# EAGLE design bqcreative_v2 (EAGLE 7.2.0)

## Sheet 1 of 3
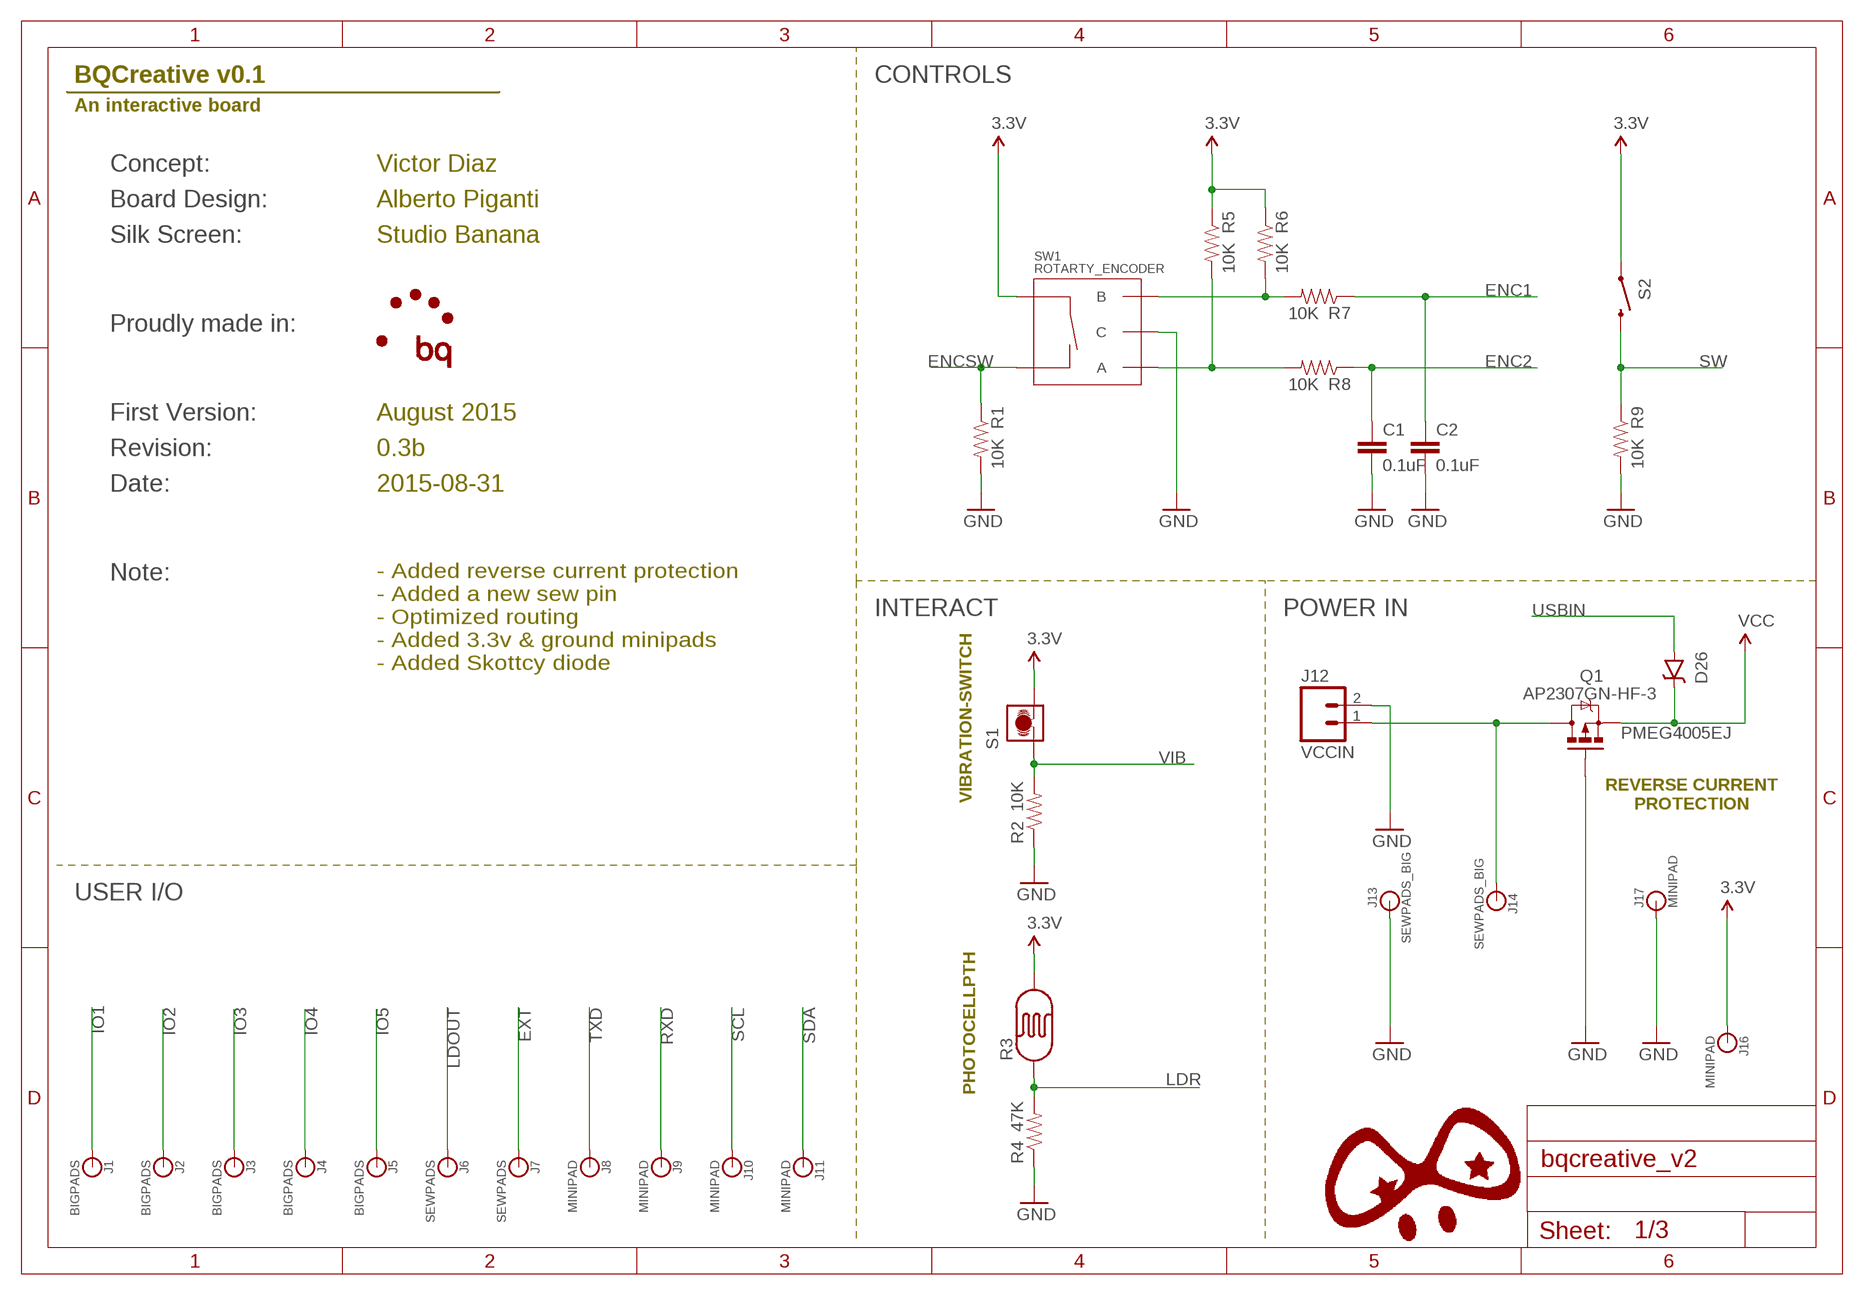
[diagram p0: schematic, sheet 1]

### Parts
C1  0.1uF  CAP0603-CAP  [0603-CAP]
C2  0.1uF  CAP0603-CAP  [0603-CAP]
D26  PMEG4005EJ  DIODE-SCHOTTKY-PMEG4005EJ  [SOD-323]
J1  BIGPADS  [BIGPAD]
J2  BIGPADS  [BIGPAD]
J3  BIGPADS  [BIGPAD]
J4  BIGPADS  [BIGPAD]
J5  BIGPADS  [BIGPAD]
J6  SEWPADS  [SEWPAD]
J7  SEWPADS  [SEWPAD]
J8  MINIPAD  [MINIPAD]
J9  MINIPAD  [MINIPAD]
J10  MINIPAD  [MINIPAD]
J11  MINIPAD  [MINIPAD]
J12  VCCIN  M02POLAR  [MOLEX-1X2]
J13  SEWPADS_BIG  [SEWPAD_BIG]
J14  SEWPADS_BIG  [SEWPAD_BIG]
J16  MINIPAD  [MINIPAD]
J17  MINIPAD  [MINIPAD]
Q1  AP2307GN-HF-3  MOSFET-PCHANNEL  [SOT23-3]
R1  10K  RESISTOR0402-RES  [0402-RES]
R2  10K  RESISTOR0402-RES  [0402-RES]
R3  PHOTOCELLPTH  [PHOTOCELL]
R4  47K  RESISTOR0402-RES  [0402-RES]
R5  10K  RESISTOR0402-RES  [0402-RES]
R6  10K  RESISTOR0402-RES  [0402-RES]
R7  10K  RESISTOR0402-RES  [0402-RES]
R8  10K  RESISTOR0402-RES  [0402-RES]
R9  10K  RESISTOR0402-RES  [0402-RES]
S1  VIBRATION-SWITCH  [VIBRATION-SWITCH]
S2  SWITCH-MOMENTARY-2SMD  [TACTILE-SWITCH-SMD]
SW1  ROTARTY_ENCODER  [ROTARY_ENC_PLAIN]

### Nets
3.3V: J16.P$1 J16.P$2 R3.2 R5.1 R6.1 S1.2 S2.1 SW1.SW+ ; also sheet 2
ENC1: C2.1 R7.1 ; also sheet 2
ENC2: C1.1 R8.1 ; also sheet 2
ENCSW: R1.1 SW1.SW- ; also sheet 2
EXT: J7.P$1 ; also sheet 2
GND: C1.2 C2.2 J12.2 J13.P$1 J17.P$1 J17.P$2 Q1.1(G) R1.2 R2.1 R4.1 R9.2 SW1.C ; also sheet 2,3
IO1: J1.P$1 ; also sheet 2
IO2: J2.P$1 ; also sheet 2
IO3: J3.P$1 ; also sheet 2
IO4: J4.P$1 ; also sheet 2
IO5: J5.P$1 ; also sheet 2
LDOUT: J6.P$1 ; also sheet 3
LDR: R3.1 R4.2 ; also sheet 2
N$15: J12.1 J14.P$1 Q1.3(D)
N$18: R6.2 R7.2 SW1.B
N$19: R5.2 R8.2 SW1.A
RXD: J9.P$1 J9.P$2 ; also sheet 2
SCL: J10.P$1 J10.P$2 ; also sheet 2
SDA: J11.P$1 J11.P$2 ; also sheet 2
SW: R9.1 S2.3 ; also sheet 2
TXD: J8.P$1 J8.P$2 ; also sheet 2
USBIN: D26.A ; also sheet 2
VCC: D26.C Q1.2(S) ; also sheet 2,3
VIB: R2.2 S1.1 ; also sheet 2

### Notes on the sheet
- BQCreative v0.1 | CONTROLS
- An interactive board
- Concept: | Victor Diaz
- Board Design: | Alberto Piganti
- Silk Screen: | Studio Banana
- Proudly made in:
- First Version: | August 2015
- Revision: | 0.3b
- Date: | 2015-08-31
- Note:
- - Added reverse current protection
  - Added a new sew pin
  - Optimized routing
  - Added 3.3v & ground minipads
  - Added Skottcy diode
- INTERACT | POWER IN
- REVERSE CURRENT
  PROTECTION
- USER I/O

## Sheet 2 of 3
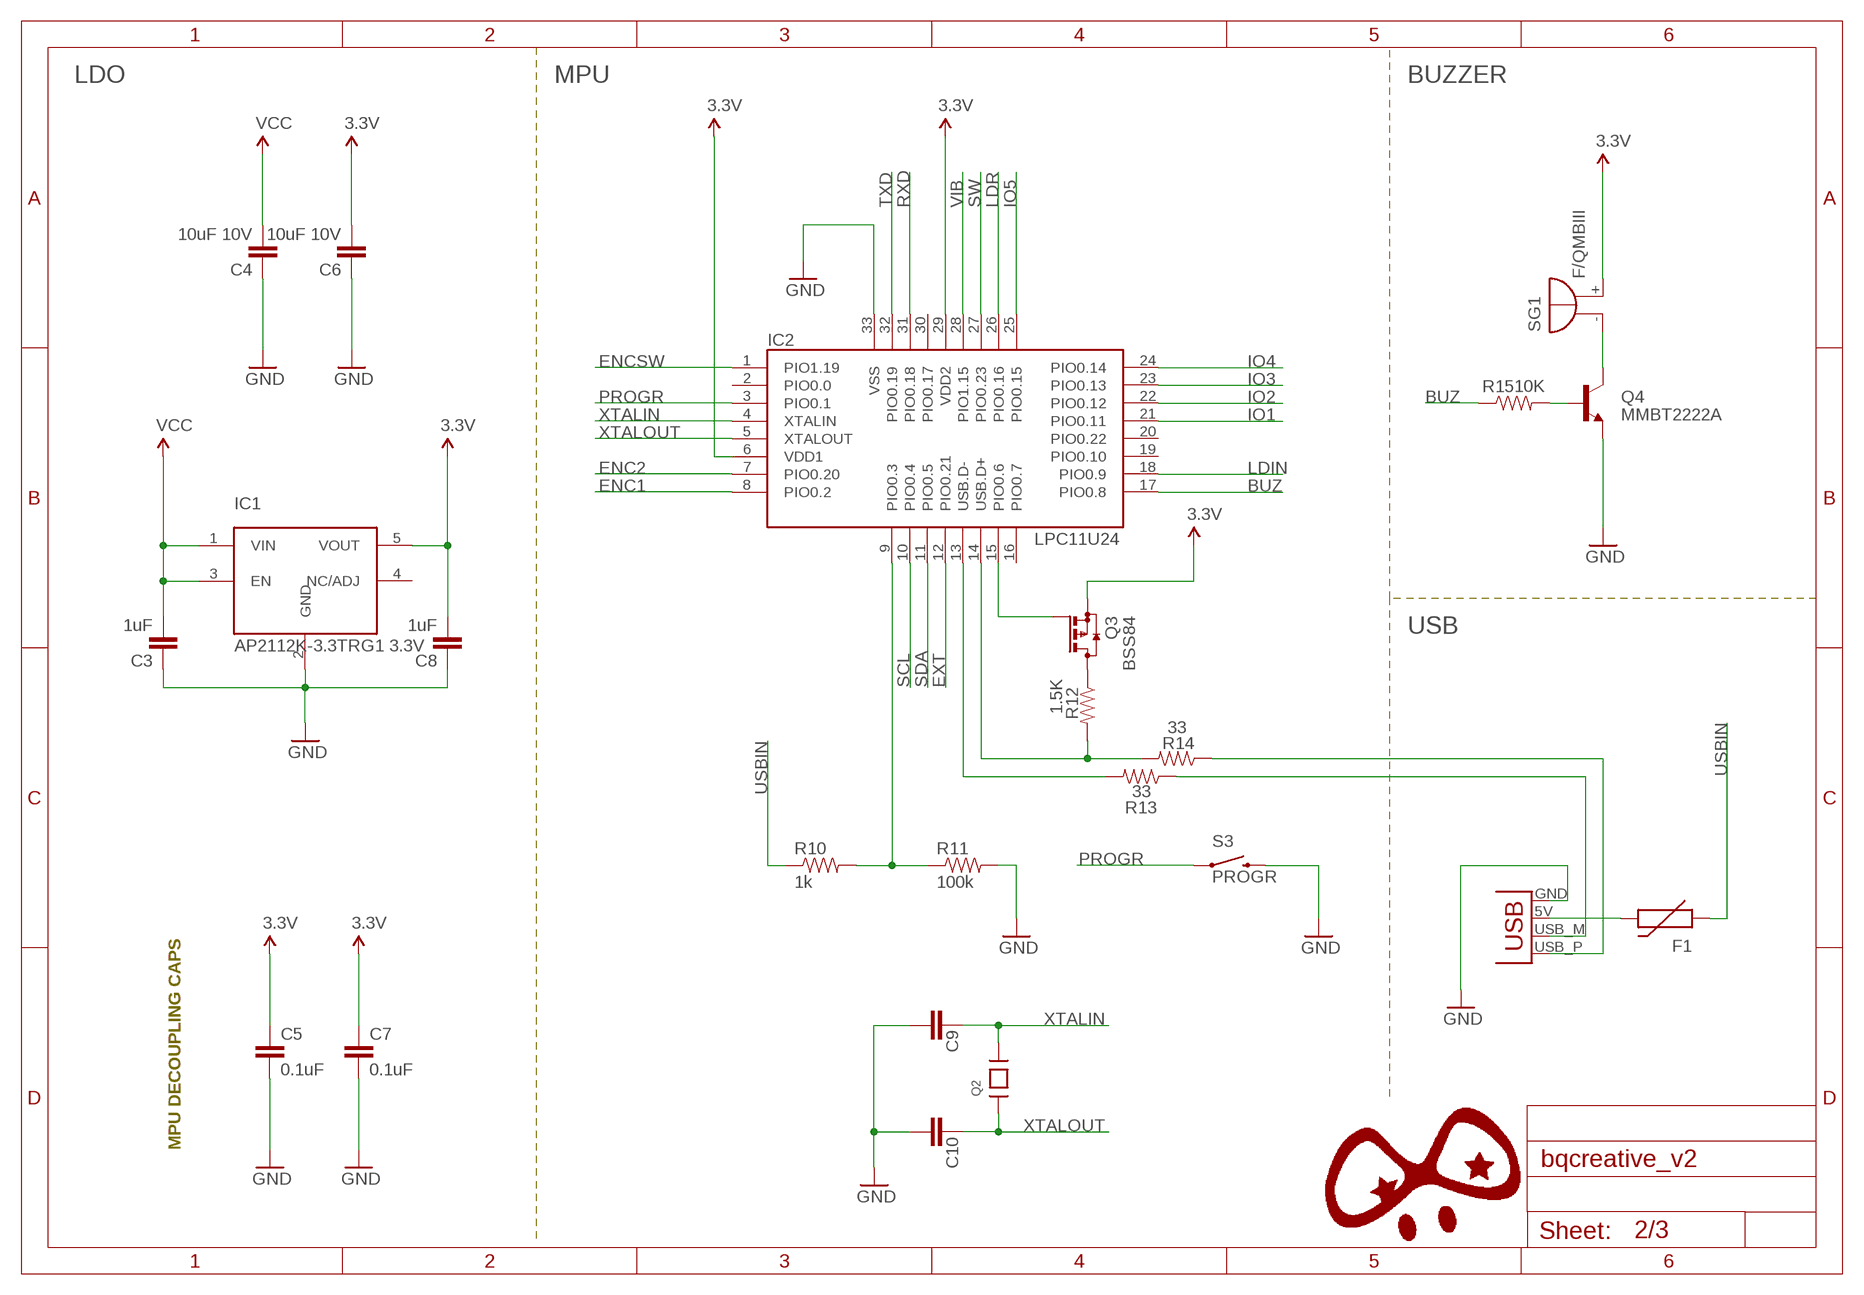
[diagram p1: schematic, sheet 2]

### Parts
C3  1uF  CAP0402-CAP  [0402-CAP]
C4  10uF 10V  CAP0402-CAP  [0402-CAP]
C5  0.1uF  CAP0402-CAP  [0402-CAP]
C6  10uF 10V  CAP0402-CAP  [0402-CAP]
C7  0.1uF  CAP0402-CAP  [0402-CAP]
C8  1uF  CAP0402-CAP  [0402-CAP]
C9  27pF  CAP0402-CAP  [0402-CAP]
C10  27pF  CAP0402-CAP  [0402-CAP]
F1  PTC0603  [0603]
IC1  AP2112K-3.3TRG1 3.3V  5PIN_REG  [SOT23-5]
IC2  LPC11U24  LPC11U2X_HVQFN33(5X5)  [HVQFN33_5X5MM]
J15  USBPCB  [USB-A-PCB]
Q2  12MHz 4 pad crystal 3.2x2.5  CRYSTAL3.2X2.5  [CRYSTAL_3.2X2.5]
Q3  BSS84  [SOT23]
Q4  MMBT2222A  TRANSISTOR_NPNMMBT2222A  [SOT23-3]
R10  1k  RESISTOR0402-RES  [0402-RES]
R11  100k  RESISTOR0402-RES  [0402-RES]
R12  1.5K  RESISTOR0402-RES  [0402-RES]
R13  33  RESISTOR0402-RES  [0402-RES]
R14  33  RESISTOR0402-RES  [0402-RES]
R15  10K  RESISTOR0402-RES  [0402-RES]
S3  PROGR  SWITCH-MOMENTARY-2SMD-1101NE  [TACTILE-SWITCH-1101NE]
SG1  F/QMBIII  [F/QMBIII]

### Nets
3.3V: C5.1 C6.2 C7.1 C8.2 IC1.5(VOUT) IC2.6(VDD1) IC2.29(VDD2) Q3.2(S) SG1.+(-) ; also sheet 1
BUZ: IC2.17(PIO0.8) R15.1
ENC1: IC2.8(PIO0.2) ; also sheet 1
ENC2: IC2.7(PIO0.20) ; also sheet 1
ENCSW: IC2.1(PIO1.19) ; also sheet 1
EXT: IC2.12(PIO0.21) ; also sheet 1
GND: C3.1 C4.1 C5.2 C6.1 C7.2 C8.1 C9.2 C10.2 IC1.2(GND) IC2.33(VSS) J15.GND Q4.2(E) R11.2 S3.2 ; also sheet 1,3
IO1: IC2.21(PIO0.11) ; also sheet 1
IO2: IC2.22(PIO0.12) ; also sheet 1
IO3: IC2.23(PIO0.13) ; also sheet 1
IO4: IC2.24(PIO0.14) ; also sheet 1
IO5: IC2.25(PIO0.15) ; also sheet 1
LDIN: IC2.18(PIO0.9) ; also sheet 3
LDR: IC2.26(PIO0.16) ; also sheet 1
N$7: Q4.3(C) SG1.-(+)
N$8: Q4.1(B) R15.2
N$9: J15.USB_P(D+) R14.1
N$10: F1.2 J15.5V(VBUS)
N$11: J15.USB_M(D-) R13.1
N$33: IC2.14(USB.D+) R12.2 R14.2
N$34: IC2.13(USB.D-) R13.2
N$35: Q3.3(D) R12.1
N$36: IC2.15(PIO0.6) Q3.1(G)
P0.3/ISP_COMMAND_USB_HIGH: IC2.9(PIO0.3) R10.2 R11.1
PROGR: IC2.3(PIO0.1) S3.1
RXD: IC2.31(PIO0.18) ; also sheet 1
SCL: IC2.10(PIO0.4) ; also sheet 1
SDA: IC2.11(PIO0.5) ; also sheet 1
SW: IC2.27(PIO0.23) ; also sheet 1
TXD: IC2.32(PIO0.19) ; also sheet 1
USBIN: F1.1 R10.1 ; also sheet 1
VCC: C3.2 C4.2 IC1.1(VIN) IC1.3(EN) ; also sheet 1,3
VIB: IC2.28(PIO1.15) ; also sheet 1
XTALIN: C9.1 IC2.4(XTALIN) Q2.3
XTALOUT: C10.1 IC2.5(XTALOUT) Q2.1
Unconnected: IC1.4(NC/ADJ) IC2.2(PIO0.0) IC2.16(PIO0.7) IC2.19(PIO0.10) IC2.20(PIO0.22) IC2.30(PIO0.17)

### Notes on the sheet
- LDO | MPU | BUZZER
- USB
- MPU DECOUPLING CAPS

## Sheet 3 of 3
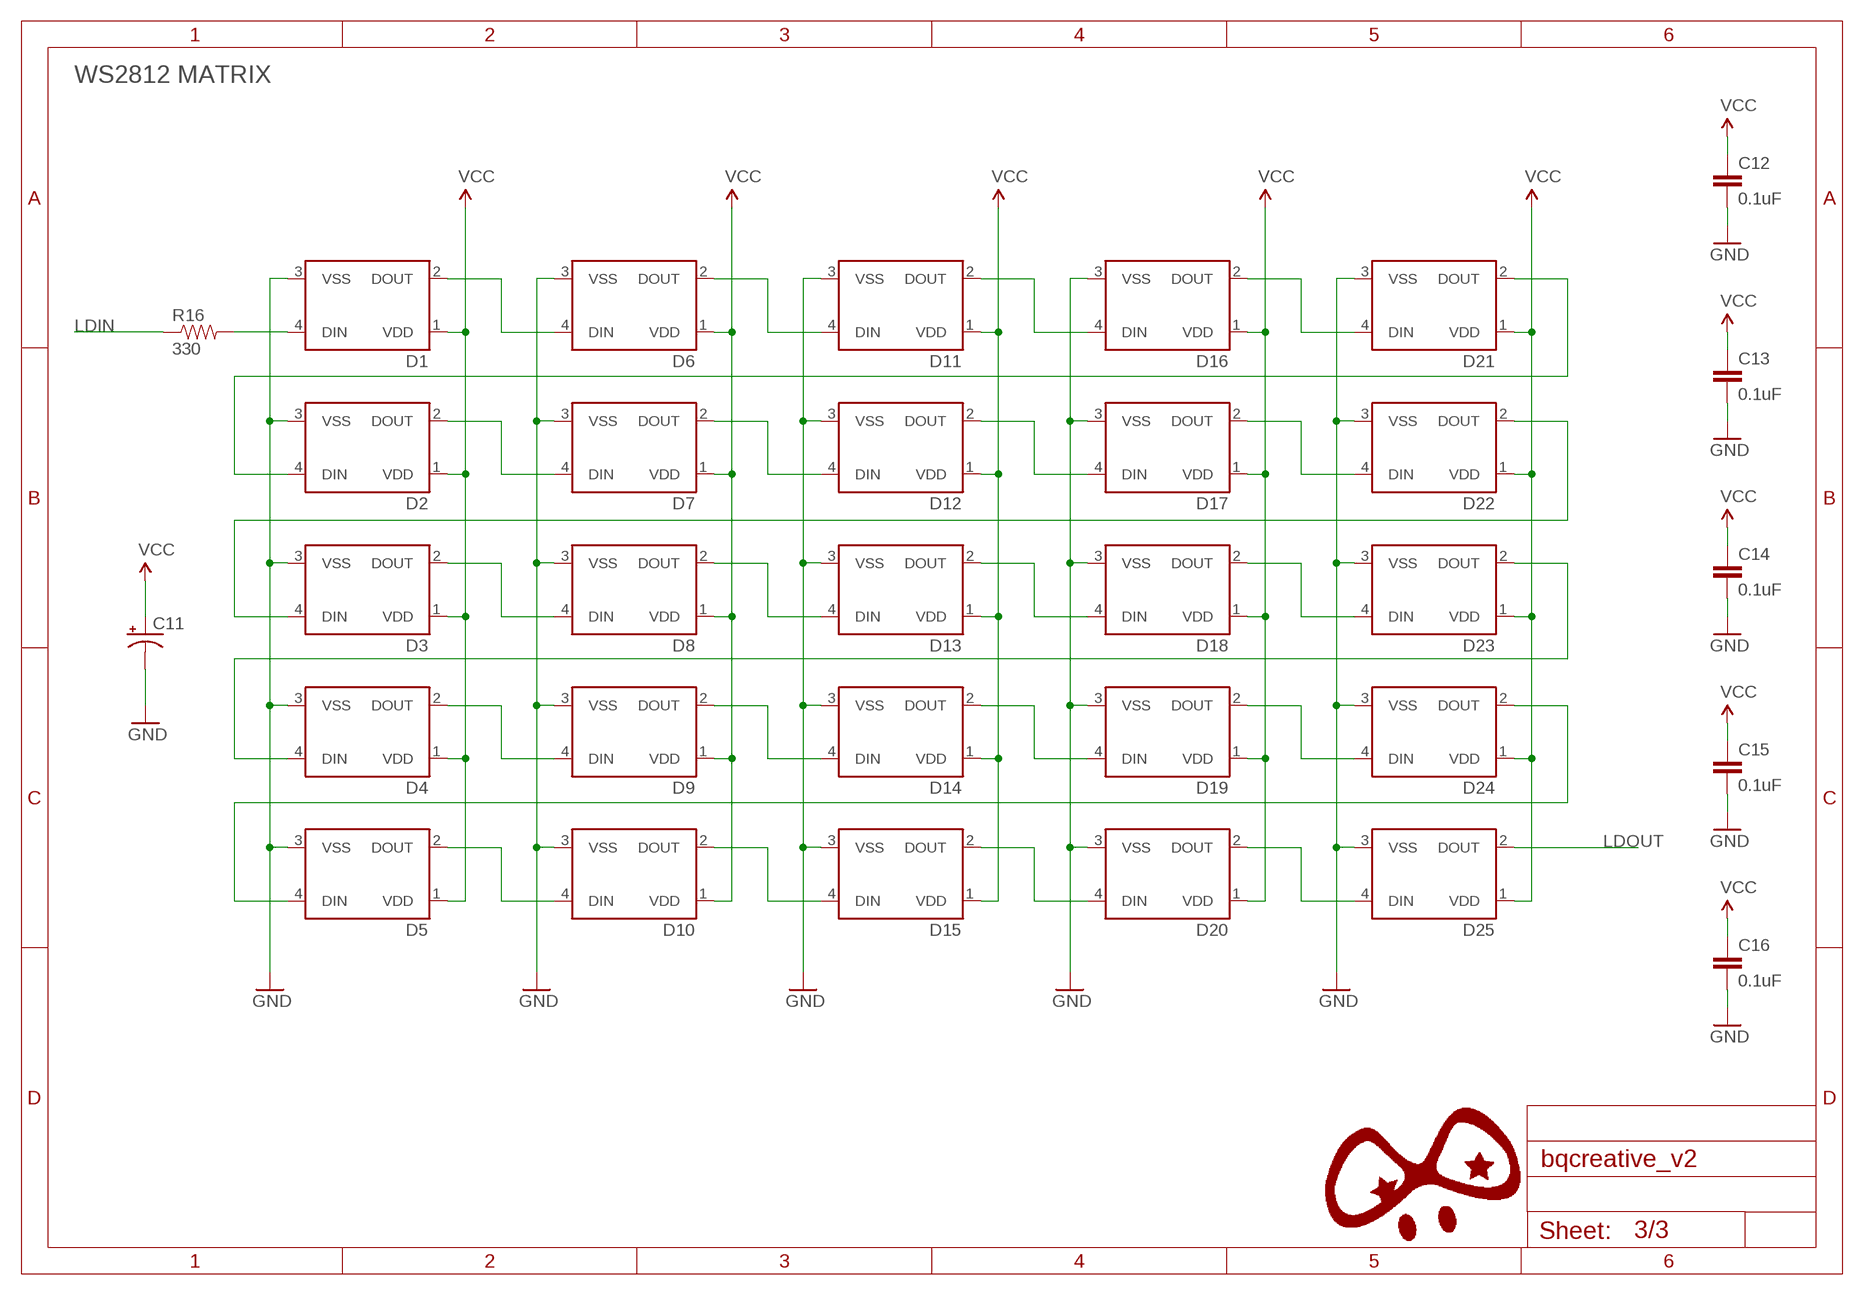
[diagram p2: schematic, sheet 3]

### Parts
C11  CAP_POL1206  [EIA3216]
C12  0.1uF  CAP0402-CAP  [0402-CAP]
C13  0.1uF  CAP0402-CAP  [0402-CAP]
C14  0.1uF  CAP0402-CAP  [0402-CAP]
C15  0.1uF  CAP0402-CAP  [0402-CAP]
C16  0.1uF  CAP0402-CAP  [0402-CAP]
D1  WS2812B  [WS2812B]
D2  WS2812B  [WS2812B]
D3  WS2812B  [WS2812B]
D4  WS2812B  [WS2812B]
D5  WS2812B  [WS2812B]
D6  WS2812B  [WS2812B]
D7  WS2812B  [WS2812B]
D8  WS2812B  [WS2812B]
D9  WS2812B  [WS2812B]
D10  WS2812B  [WS2812B]
D11  WS2812B  [WS2812B]
D12  WS2812B  [WS2812B]
D13  WS2812B  [WS2812B]
D14  WS2812B  [WS2812B]
D15  WS2812B  [WS2812B]
D16  WS2812B  [WS2812B]
D17  WS2812B  [WS2812B]
D18  WS2812B  [WS2812B]
D19  WS2812B  [WS2812B]
D20  WS2812B  [WS2812B]
D21  WS2812B  [WS2812B]
D22  WS2812B  [WS2812B]
D23  WS2812B  [WS2812B]
D24  WS2812B  [WS2812B]
D25  WS2812B  [WS2812B]
R16  330  RESISTOR0402-RES  [0402-RES]

### Nets
GND: C11.C(-) C12.2 C13.2 C14.2 C15.2 C16.2 D1.3(VSS) D2.3(VSS) D3.3(VSS) D4.3(VSS) D5.3(VSS) D6.3(VSS) D7.3(VSS) D8.3(VSS) D9.3(VSS) D10.3(VSS) D11.3(VSS) D12.3(VSS) D13.3(VSS) D14.3(VSS) D15.3(VSS) D16.3(VSS) D17.3(VSS) D18.3(VSS) D19.3(VSS) D20.3(VSS) D21.3(VSS) D22.3(VSS) D23.3(VSS) D24.3(VSS) D25.3(VSS) ; also sheet 1,2
LDIN: R16.1 ; also sheet 2
LDOUT: D25.2(DOUT) ; also sheet 1
N$13: D1.4(DIN) R16.2
N$22: D1.2(DOUT) D6.4(DIN)
N$27: D6.2(DOUT) D11.4(DIN)
N$32: D11.2(DOUT) D16.4(DIN)
N$40: D16.2(DOUT) D21.4(DIN)
N$41: D2.2(DOUT) D7.4(DIN)
N$46: D7.2(DOUT) D12.4(DIN)
N$49: D12.2(DOUT) D17.4(DIN)
N$52: D17.2(DOUT) D22.4(DIN)
N$53: D3.2(DOUT) D8.4(DIN)
N$58: D8.2(DOUT) D13.4(DIN)
N$61: D13.2(DOUT) D18.4(DIN)
N$64: D18.2(DOUT) D23.4(DIN)
N$65: D4.2(DOUT) D9.4(DIN)
N$70: D9.2(DOUT) D14.4(DIN)
N$73: D14.2(DOUT) D19.4(DIN)
N$76: D19.2(DOUT) D24.4(DIN)
N$77: D5.2(DOUT) D10.4(DIN)
N$82: D10.2(DOUT) D15.4(DIN)
N$85: D15.2(DOUT) D20.4(DIN)
N$88: D20.2(DOUT) D25.4(DIN)
N$91: D2.4(DIN) D21.2(DOUT)
N$92: D3.4(DIN) D22.2(DOUT)
N$93: D4.4(DIN) D23.2(DOUT)
N$94: D5.4(DIN) D24.2(DOUT)
VCC: C11.A(+) C12.1 C13.1 C14.1 C15.1 C16.1 D1.1(VDD) D2.1(VDD) D3.1(VDD) D4.1(VDD) D5.1(VDD) D6.1(VDD) D7.1(VDD) D8.1(VDD) D9.1(VDD) D10.1(VDD) D11.1(VDD) D12.1(VDD) D13.1(VDD) D14.1(VDD) D15.1(VDD) D16.1(VDD) D17.1(VDD) D18.1(VDD) D19.1(VDD) D20.1(VDD) D21.1(VDD) D22.1(VDD) D23.1(VDD) D24.1(VDD) D25.1(VDD) ; also sheet 1,2

### Notes on the sheet
- WS2812 MATRIX

## Library data of the parts
C1 C2 = SparkFun-Capacitors:CAP: Capacitor Standard 0603 ceramic capacitor, and 0.1" leaded capacitor.
C3-C10 C12-C16 = SparkFun-Passives:CAP: Capacitor Standard 0603 ceramic capacitor, and 0.1" leaded capacitor.
C11 = SparkFun-Capacitors:CAP_POL: Capacitor Polarized These are standard SMD and PTH capacitors. Normally 10uF, 47uF, and 100uF in electrolytic and tantalum varieties. Always verify the external diameter of the through hole cap, it varies with capacity, voltage, and manufacturer. The EIA devices should be standard.
D1-D25 = SparkFun-LED:WS2812B: WS2812B - Intelligent control LED integrated light source Technical Specifications: Power Supply Voltage (VDD): 3.5 to 5.3 V Input Voltage (VI): -0.5 to VDD+0.5 V Operating Junction Temperature (Topt): -25°C to +80°C Storage Temperature Range (Tstg): -55°C to +150°C
D26 = SparkFun-DiscreteSemi:DIODE-SCHOTTKY: Schottky diodes in SFE's production catalog BAT20J 1A 23V 0.62Vf RB751 120mA 40V 0.37Vf PMEG4005EJ 0.5A 40V 0.42Vf MBRA140 1A 40V 0.5Vf B340A 3A 40V SMA; PROD_ID: DIO-10955
F1 = SparkFun-PowerIC:PTC: Resettable Fuse PTC Resettable Fuse. Spark Fun Electronics SKU : COM-08357
IC1 = GHI:5PIN_REG
IC2 = GHI-SoMs-Processors:LPC11U2X_HVQFN33(5X5)
J1-J5 = bqCreative:BIGPADS: BQCreative Pads
J6 J7 = bqCreative:SEWPADS
J8-J11 J16 J17 = bqCreative:MINIPAD: BQCreative mini pads for signals
J12 = SparkFun-Connectors:M02: Standard 2-pin 0.1" header. Use with - straight break away headers ( PRT-00116) - right angle break away headers (PRT-00553) - swiss pins (PRT-00743) - machine pins (PRT-00117) - female headers (PRT-00115) Molex polarized connector foot print use with: PRT-08233 with associated crimp pins and housings. 2.54_SCREWTERM for use with PRT-10571. 3.5mm Screw Terminal footprints for PRT-08084 5mm Screw Terminal footprints for use with PRT-08432
J13 J14 = bqCreative:SEWPADS_BIG: BQCreative Sew pads (bottom)
J15 = SparkFun-Connectors:USB: USB Connectors USB-B-PTH is fully proven SKU : PRT-00139/CONN-08278 USB-miniB is fully proven SKU : PRT-00587 USB-A-PCB is untested. USB-A-H is throughly reviewed, but untested. Spark Fun Electronics SKU : PRT-00437 USB-B-SMT is throughly reviewed, but untested. Needs silkscreen touching up. USB-A-S has not been used/tested USB-MB-H has not been used/tested USB-MICROB has been used. CONN-09505
Q1 = SparkFun-DiscreteSemi:MOSFET-PCHANNEL: Generic PMOSFET IRLML2244 - TRANS-11153 (SOT-23 -20V -4.3A) (1.Gate 2.Source 3.Drain) FQP27P06 - COM-10349 (TO-220 -60V -27A) (1.Gate 2.Source 3.Drain); PROD_ID: TRANS-08285
Q2 = GHI:CRYSTAL3.2X2.5
Q3 = transistor-small-signal:BSS84: P-CHANNEL MOS FET
Q4 = SparkFun-DiscreteSemi:TRANSISTOR_NPN: Generic NPN BJT MMBT2222A - TRANS-08049 (SOT-23, 1A 40V) MPSA42 - TRANS-09116 (SOT-23, 500mA 300V) MMBT5088LT1G - TRANS-11160 (SOT-23, 50 mA 30V) BC547 - COM-08928 (TO-92 45V 100mA) (1.Collector 2.Base 3.Emitter) 2N3904 - COM-00521 (TO-92 40V 200mA) (1.Emitter 2.Base 3.Collector) P2N2222A - COM-12852 (TO-92 40V 600mA) (1.Collector 2.Base 3.Emitter); PROD_ID: TRANS-08049
R1 R2 R4-R9 R15 = SparkFun:RESISTOR: Resistor Basic schematic elements and footprints for 0603, 1206, and PTH resistors.
R3 = SparkFun-Sensors:PHOTOCELL: CdS photoresistor. This is a low cost way to detect light levels. Resistance decreases with more incoming light. SparkFun SKU: SEN-09088
R10-R14 R16 = SparkFun-Passives:RESISTOR: Resistor Basic schematic elements and footprints for 0603, 1206, and PTH resistors.
S1 = mic2026:VIBRATION-SWITCH
S2 = SparkFun-Electromechanical:SWITCH-MOMENTARY-2: Various NO switches- pushbuttons, reed, etc; PROD_ID: SWCH-08247
S3 = SparkFun-Electromechanical:SWITCH-MOMENTARY-2: Various NO switches- pushbuttons, reed, etc; PROD_ID: SWCH-00815
SG1 = buzzer:F/QMBIII: BUZZER Source: Buerklin; OC_FARNELL: unknown; OC_NEWARK: unknown
SW1 = SparkFun-Electromechanical:ROTARTY_ENCODER: Simple no LED rotary encoder Example: COM-09117

## Net classes
0 default: width 0.254 mm, drill 0.254 mm, clearance 0.203 mm
1 power: width 0.61 mm, drill 0.61 mm, clearance 0.254 mm

## Board
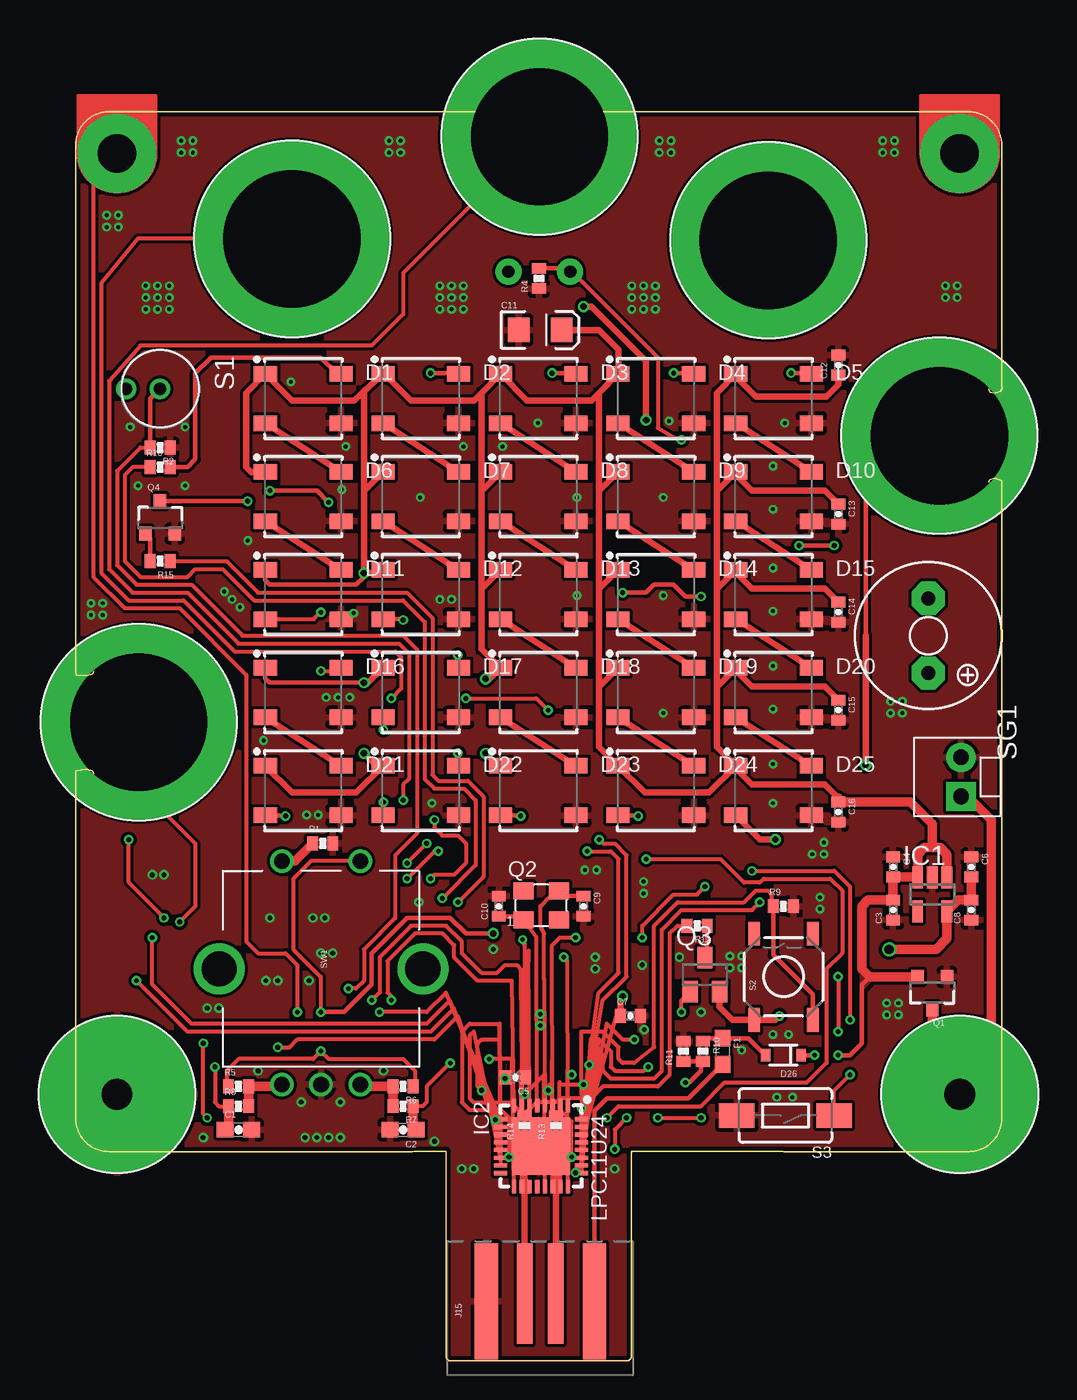
[diagram p3: board, top side]
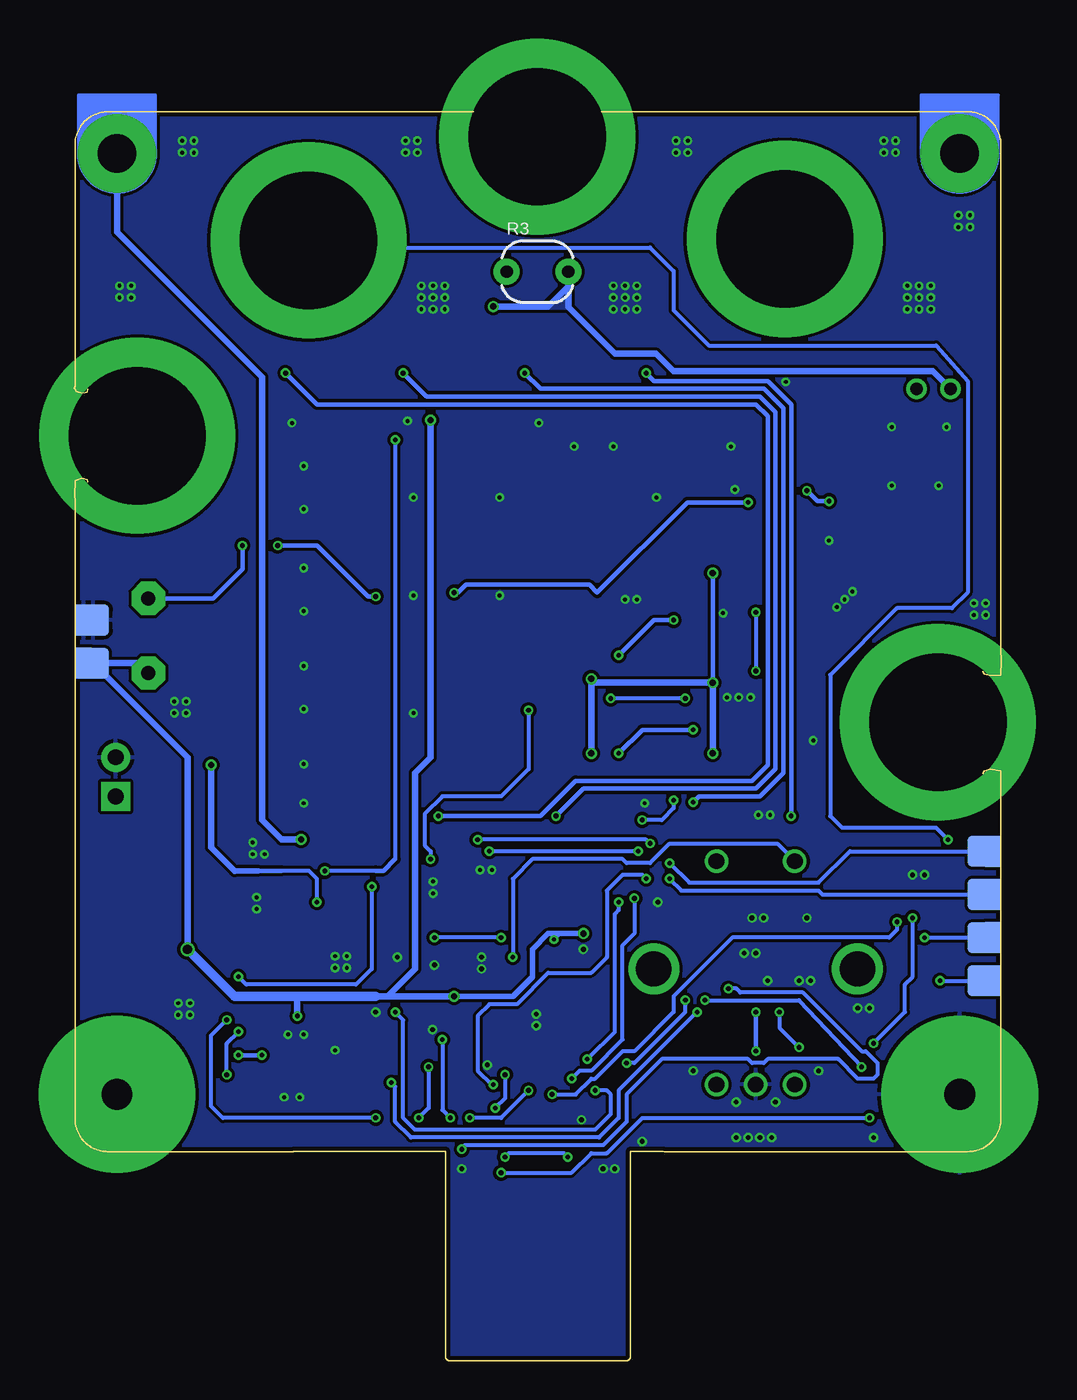
[diagram p4: board, bottom side, seen from below]

Size 60.06 x 80.94 mm. Coordinates in mm from the lower left corner, seen from the top.
Outline: 304 segments
Copper layers (1*16): Top 0.035mm / dielectric 1.5mm / Bottom 0.035mm
Design rules "pighixxx_CAM_DRC_V1.5": minimum track width 6mil, minimum drill 10mil, track to track 6mil, track to pad 6mil, pad to pad 6mil, via to via 6mil, smd to smd 0mil, copper to edge 10mil, drill to drill 10mil, minimum pad ring 10mil, minimum via ring 6mil, stop-mask expansion 2mil, vias tented up to drill 100mil, thermal gap 10mil

### Footprints (pad centres in the part's own frame; a part is rotated, then mirrored left to right if it is on the bottom)
0603-CAP = smd 1.1 x 1: 1 -0.85,0; 2 0.85,0
0402-CAP = smd 0.7 x 0.9: 1 -0.65,0; 2 0.65,0
EIA3216 = smd 1.4 x 1.6: A 1.4,0; C -1.4,0
WS2812B = smd 1.5 x 1: 1 -2.45,1.6; 2 -2.45,-1.6; 3 2.45,-1.6; 4 2.45,1.6
SOD-323 = smd 0.63 x 0.83: A 1.15,0; C -1.15,0
0603 = smd 1.1 x 1: 1 -0.85,0; 2 0.85,0
SOT23-5 = smd 0.7 x 1.4: 1 0.95,1.1; 2 0,1.1; 3 -0.95,1.1; 4 -0.95,-1.1; 5 0.95,-1.1
HVQFN33_5X5MM = smd 0.85 x 0.27: 1 -2.625,1.75; 2 -2.625,1.25; 3 -2.625,0.75; 4 -2.625,0.25; 5 -2.625,-0.25; 6 -2.625,-0.75; 7 -2.625,-1.25; 8 -2.625,-1.75; 17 2.625,-1.75; 18 2.625,-1.25; 19 2.625,-0.75; 20 2.625,-0.25; 21 2.625,0.25; 22 2.625,0.75; 23 2.625,1.25; 24 2.625,1.75 | smd 0.27 x 0.85: 9 -1.75,-2.625; 10 -1.25,-2.625; 11 -0.75,-2.625; 12 -0.25,-2.625; 13 0.25,-2.625; 14 0.75,-2.625; 15 1.25,-2.625; 16 1.75,-2.625; 25 1.75,2.625; 26 1.25,2.625; 27 0.75,2.625; 28 0.25,2.625; 29 -0.25,2.625; 30 -0.75,2.625; 31 -1.25,2.625; 32 -1.75,2.625 | smd 3.75 x 3.75: 33 0,0
BIGPAD = drill 8.89 pad 12.7: P$1 0,0
SEWPAD = drill 2.5 pad 5.08: P$1 0,0
MINIPAD = smd 1 x 2: P$1 0.635,0 | smd 2 x 2: P$2 0,0
MOLEX-1X2 = drill 1.016 pad 1.88 square: 1 0,0 | drill 1.016 pad 1.88: 2 2.54,0
SEWPAD_BIG = drill 2 pad 10.16: P$1 0,0
USB-A-PCB = smd 7.5 x 1.5: 5V -0.2,-3.5; GND -0.2,3.5 | smd 6.5 x 1: USB_M 0.3,-1; USB_P 0.3,1
SOT23-3 = smd 0.8 x 0.9: 1 -0.95,-1; 2 0.95,-1; 3 0,1.1
CRYSTAL_3.2X2.5 = smd 1.3 x 1.1: 1 -1.1,-0.9; 2 1.2,-0.9; 3 1.2,1; 4 -1.1,1
SOT23 = smd 1 x 1.4: 1 -0.95,-1.1; 2 0.95,-1.1; 3 0,1.1
0402-RES = smd 0.7 x 0.9: 1 -0.65,0; 2 0.65,0
PHOTOCELL = drill 0.8 pad 1.676: 1 -2,0; 2 2,0
VIBRATION-SWITCH = drill 0.813: 1 0,0; 2 0,-2.2
TACTILE-SWITCH-SMD = smd 1.524 x 0.762: 1 -2.794,1.905; 2 2.794,1.905; 3 -2.794,-1.905; 4 2.794,-1.905
TACTILE-SWITCH-1101NE = smd 2.3 x 1.6: 1 -3.15,0; 2 3.15,0
F/QMBIII = drill 0.914 pad 2.159 octagon: + 2.416,0; - -2.416,0
ROTARY_ENC_PLAIN = drill 1.016: A 7.493,-2.54; B 7.493,2.54; C 7.493,0; SW+ -6.985,2.54; SW- -6.985,-2.54 | drill 2.286: P$3 0,6.604; P$4 0,-6.604

### Placement (x,y rotation side)
C1  10.56,14.98 0 top
C2  21.23,14.98 180 top
C3  52.98,29.21 90 top
C4  52.98,32 270 top
C5  28.52,18.36 180 top
C6  58.06,32 270 top
C7  35.96,22.35 0 top
C8  58.06,29.21 90 top
C9  32.92,29.46 270 top
C10  27.43,29.46 90 top
C11  30.12,66.8 0 top
C12  49.43,64.51 90 top
C13  49.43,54.86 270 top
C14  49.43,48.51 270 top
C15  49.43,42.16 270 top
C16  49.43,35.56 270 top
D1  14.75,62.36 0 top
D2  22.37,62.36 0 top
D3  29.99,62.36 0 top
D4  37.61,62.36 0 top
D5  45.23,62.36 0 top
D6  14.75,56.01 0 top
D7  22.37,56.01 0 top
D8  29.99,56.01 0 top
D9  37.61,56.01 0 top
D10  45.23,56.01 0 top
D11  14.75,49.66 0 top
D12  22.37,49.66 0 top
D13  29.99,49.66 0 top
D14  37.61,49.66 0 top
D15  45.23,49.66 0 top
D16  14.75,43.31 0 top
D17  22.37,43.31 0 top
D18  29.99,43.31 0 top
D19  37.61,43.31 0 top
D20  45.23,43.31 0 top
D21  14.75,36.96 0 top
D22  22.37,36.96 0 top
D23  29.99,36.96 0 top
D24  37.61,36.96 0 top
D25  45.23,36.96 0 top
D26  45.87,19.81 180 top
F1  41.93,20.06 270 top
IC1  55.52,30.22 0 top
IC2  30.17,13.92 270 top
J1  4.1,41.38 0 top
J2  14.02,72.7 0 top
J3  30.06,79.33 0 top
J4  44.89,72.6 0 top
J5  55.99,59.94 0 top
J6  57.3,78.23 0 top
J7  2.69,78.23 0 top
J8  1.17,30.22 0 bottom
J9  1.17,33.02 0 bottom
J10  1.17,27.43 0 bottom
J11  1.17,24.64 0 bottom
J12  57.39,36.57 90 top
J13  2.69,17.27 0 top
J14  57.3,17.27 0 top
J15  30.12,4.06 90 top
J16  58.82,45.21 180 bottom
J17  58.82,48 180 bottom
Q1  55.52,23.87 180 top
Q2  30.12,29.46 0 top
Q3  40.79,25.02 0 top
Q4  5.48,54.61 0 top
R1  16.02,33.53 0 top
R2  5.48,59.18 180 top
R3  30.05,70.58 0 bottom
R4  30.03,70.14 90 top
R5  10.56,17.78 0 top
R6  21.23,17.78 180 top
R7  21.23,16.51 180 top
R8  10.56,16.51 0 top
R9  45.87,29.46 0 top
R10  40.66,20.06 270 top
R11  39.39,20.06 90 top
R12  40.28,28.19 180 top
R13  31.14,15.24 90 top
R14  29.11,15.24 90 top
R15  5.48,51.81 180 top
R16  5.48,57.91 0 top
S1  5.48,62.99 270 top
S2  45.88,24.89 90 top
S3  46.01,15.9 180 top
SG1  55.27,46.99 270 top
SW1  15.91,25.4 270 top
U$1  [CIRCOLAB_LOGO]  37.59,48 0 top
U$2  [CIRCOLAB_BQ_LOGO]  49.32,21.79 0 top

### Tracks (layer width: path | path; a pad name or v marks a point on that pad's centre or on a via)
3.3V  (via drill 0.25, 0.3, 0.41, 0.6 pad 0.61)
  Top 0.254: IC2.6 29.37,26.57 C5.1 29.12,26.91 29.11,26.92 29.11,27.05 v28.98,27.3 | IC2.29 35.06,22.35 C7.1 | 9.8,17.89 9.8,18.79 10.56,19.56 15.39,19.56 v15.9,20.06 16.41,19.56 21.23,19.56 21.99,18.79 21.99,17.89 R6.1 | SW1.SW+ 15.26,32.38 14.12,31.24 14.12,26.67 15.9,24.89 v15.9,22.6
  Top 0.305: v27.07,27.68 25.3,27.68 24.28,28.7 21.49,28.7 19.2,26.41 19.2,24.38 17.42,22.6 v15.9,22.6
  Top 0.406: v36.98,60.96 36.98,64.77 33.42,68.32 v32.92,68.32 | R5.1 9.8,17.89 | R6.1 21.74,17.92 | C7.1 35.31,23.22 v35.46,23.62 | v45.62,22.35 45.36,22.1 S2.1 42.57,22.1 41.74,22.92 Q3.2
  Top 0.61: C6.2 C8.2 57.21,29.86 IC1.5 56.47,27.36 55.78,26.67 v52.73,26.67
  Bottom 0.254: v28.98,27.3 28.6,27.68 | J16.P$2 J16.P$1
  Bottom 0.305: v15.9,20.06 v15.9,22.6
  Bottom 0.356: v27.07,27.68 28.6,27.68 29.36,27.68 30.38,26.67 30.38,24.89 31.65,23.62 v35.46,23.62
  Bottom 0.406: v32.92,68.32 29.36,68.32 28.05,69.63 R3.2 28.05,68.29 25.04,65.28 22.37,65.28 21.23,64.13 4.43,64.13 S1.2 | 50.95,24.89 v52.73,26.67 52.73,39.11 J16.P$2 55.91,45.21 SG1.+ | v35.46,23.62 39.77,23.62 | 39.77,23.62 40.54,23.62 | 39.77,23.62 38,25.4 38,38.1 36.98,39.11 v36.98,60.96 | v45.62,22.35 45.62,23.37 45.36,23.62
  Bottom 0.61: 40.54,23.62 45.36,23.62 49.68,23.62 v52.73,26.67
  pour Bottom: 28.09,69.59 28.09,68.32 29.36,68.32
BUZ  (via drill 0.3)
  Top 0.254: R15.1 9.8,51.81 11.83,49.78 21.49,49.78 23.14,48.13 23.14,37.97 23.52,37.59 25.42,37.59 26.44,36.57 26.44,31.37 v24.79,29.72 | IC2.17 28.29,19.56 v26.82,19.56
  Bottom 0.254: v26.82,19.56 25.04,21.33 25.04,28.95 24.79,29.21 v24.79,29.72
ENC1  (via drill 0.3)
  Top 0.254: IC2.8 28.29,24.64 26.06,24.64 24.53,26.16 24.53,26.92 23.77,27.68 21.99,27.68 20.22,25.91 20.22,23.87 20.47,23.62 v20.47,23.37 | v24.28,19.3 22.76,17.78 22.76,16.76 22.5,16.51 R7.1
  Top 0.61: R7.1 21.88,15.18 C2.1
  Bottom 0.254: v24.28,19.3 23.77,19.3 20.47,22.6 v20.47,23.37
ENC2  (via drill 0.3)
  Top 0.254: IC2.7 28.85,24.74 28.85,25.4 28.6,25.65 27.84,25.65 27.33,25.14 26.31,25.14 25.04,26.41 25.04,27.18 24.03,28.19 21.74,28.19 19.71,26.16 19.71,23.87 v19.2,23.37 | v9.04,19.05 9.04,16.76 9.29,16.51 R8.1
  Top 0.61: R8.1 9.91,15.18 C1.1
  Bottom 0.254: v19.2,23.37 13.1,23.37 v9.04,19.05
ENCSW  (via drill 0.3)
  Top 0.254: IC2.1 31.87,25.93 v31.65,26.16
  Top 0.61: SW1.SW- 14.23,32.38 R1.1
  Bottom 0.254: SW1.SW- 14.51,33.53 21.49,33.53 22.76,32.26 24.28,32.26 24.53,32.51 30.38,32.51 31.65,31.24 v31.65,26.16
EXT  (via drill 0.3)
  Top 0.254: J7.P$1 1.17,76.2 1.17,50.8 3.2,48.77 6.75,48.77 11.07,44.45 11.07,27.18 11.83,26.41 13.61,26.41 14.37,25.65 v14.37,22.6 | IC2.12 24.78,22.35 23.26,20.83 14.37,20.83 13.87,20.32 v13.1,20.32
  Bottom 0.254: v14.37,22.6 14.37,21.59 v13.1,20.32
GND  (via drill 0.25, 0.3)
  Top 0.254: D11.3 17.26,48.11 v18.02,48.45
  other vias: 17.26,56.45 22.34,55.95 25.13,59.25 17.51,59.25 32.5,55.95 38.09,55.95 38.09,49.6 32.5,49.6 45.2,55.18 45.96,60.77 38.47,60.9 29.96,60.77 45.2,42.23 45.2,36.13 45.2,48.58 38.09,41.98 45.2,38.67 45.2,45.02 45.2,51.37 45.2,57.98 27.67,59.25 7.1,60.52 7.1,56.71 4.05,56.71 11.16,53.15 5.32,68.9 4.56,68.9 4.56,68.14 5.32,68.14 2.02,74.23 2.78,74.23 2.78,73.47 2.02,73.47 6.85,79.06 6.85,78.3 7.61,78.3 7.61,79.06 20.31,79.06 21.07,79.06 21.07,78.3 20.31,78.3 6.08,68.9 6.08,68.14 6.08,69.66 5.32,69.66 4.56,69.66 23.61,69.66 24.37,69.66 25.13,69.66 25.13,68.9 24.37,68.9 23.61,68.9 23.61,68.14 24.37,68.14 25.13,68.14 37.58,69.66 36.82,69.66 36.06,69.66 36.06,68.9 36.82,68.9 37.58,68.9 37.58,68.14 36.82,68.14 36.06,68.14 13.96,63.44 30.12,22.48 30.12,21.72 39.14,26.16 19.96,18.79 11.83,18.79 14.88,14.48 15.64,14.48 16.41,14.48 17.17,14.48 36.73,25.65 40.54,22.6 25.04,12.44 25.8,12.44 27.07,26.67 4.98,31.49 5.74,31.49 3.54,60.52 53.07,79.06 53.07,78.3 52.31,78.3 52.31,79.06 56.38,69.66 57.14,69.66 57.14,68.9 56.38,68.9 37.83,79.06 38.6,79.06 38.6,78.3 37.83,78.3 34.95,12.44 9.64,49.85 10.15,49.34 10.66,48.83 1,49.09 1,48.33 1.77,49.09 1.77,48.33 24.37,49.34 23.61,49.34 16.24,42.99 17.01,42.99 17.77,42.99 33.68,26.16 33.3,19.18 36.85,21.46 15.74,35.37 14.97,35.37 48.25,30.04 48.25,29.28 52.57,22.42 53.33,22.42 52.57,23.18 53.33,23.18 52.82,41.98 53.58,41.98 53.58,42.74 52.82,42.74 47.74,32.83 48.5,32.83 48.5,33.59 27.2,15.62 45.2,21.15 46.22,21.15 43.17,20.13 42.41,26.23 43.17,26.23 43.17,25.47 42.41,25.47 36.82,31.05 36.82,30.29 33.01,31.82 33.77,31.82 33.68,25.4 12.6,28.7 15.39,28.7 16.15,28.7 23.1,36.13 23.26,14.22 15.9,26.41 16.66,26.41 12.34,24.64 13.1,24.64 8.53,22.86 9.29,22.86 15.14,24.64 14.63,16.76 17.17,16.76 8.28,14.48 22.25,29.72 12.18,40.2 45.45,17.08 46.47,17.08
  pour Top (rank 2): -1.12,82.04 -1.12,12.19 23.01,12.19 23.01,-1.02 37.23,-1.02 37.23,12.19 61.11,12.19 61.11,82.04
  pour Bottom (rank 2): -1.12,82.04 -1.12,12.19 23.01,12.19 23.01,-1.02 37.23,-1.02 37.23,12.19 61.11,12.19 61.11,82.04
IO1  (via drill 0.3)
  Top 0.254: IC2.21 30.37,18.54 v29.11,17.27 | J1.P$1 4.1,37.2 7.77,33.53 7.77,29.46 v6.75,28.45
  Bottom 0.254: v6.75,28.45 6.75,27.94 7.26,27.43 17.42,27.43 21.23,23.62 21.23,22.6 23.77,20.06 24.53,20.06 26.31,18.29 26.57,18.29 27.58,17.27 v29.11,17.27
IO2  (via drill 0.3)
  Top 0.254: J2.P$1 4.02,72.7 1.67,69.85 1.67,51.05 3.45,49.27 7.01,49.27 10.31,45.97 20.72,45.97 21.1,45.59 21.1,43.56 v20.47,42.92 | v25.3,42.92 29.87,42.92 v30.63,42.16 | v36.98,32.51 41.81,32.51 43.33,30.99 44.35,30.99 44.6,31.24 48.92,31.24 49.68,30.48 49.68,26.41 48.66,25.4 48.66,19.3 47.39,18.03 42.06,18.03 40.54,16.51 35.2,16.51 v34.44,15.75 | IC2.22 30.88,19.46 30.88,18.03 30.63,17.78 v30.63,17.52
  Bottom 0.254: v20.47,42.92 v25.3,42.92 | v30.63,42.16 30.63,38.35 32.41,36.57 36.22,36.57 37.36,35.43 37.36,33.4 36.98,33.02 v36.98,32.51 | v30.63,17.52 32.41,15.75 v34.44,15.75
IO3  (via drill 0.3)
  Top 0.254: J3.P$1 21.23,70.5 21.23,67.82 19.2,65.78 4.21,65.78 2.18,63.5 2.18,51.31 3.71,49.78 7.26,49.78 10.56,46.48 20.98,46.48 21.61,45.85 21.61,37.72 21.23,37.34 v21.23,36.32 | IC2.23 31.37,18.05 31.52,17.91 v32.92,17.91 | v23.26,35.05 23.26,34.54 23.77,34.03 24.79,34.03 25.3,33.53 25.3,32.26 24.53,31.49 23.26,31.49 v23.01,31.24
  Bottom 0.254: v21.23,36.32 21.23,35.81 21.99,35.05 v23.26,35.05 | v23.01,31.24 23.26,31.49 24.53,31.49 25.55,30.48 25.55,26.16 26.57,25.14 29.36,25.14 31.39,23.11 33.17,23.11 33.93,22.35 33.93,18.79 33.04,17.91 v32.92,17.91
IO4  (via drill 0.3)
  Top 0.254: IC2.24 31.87,18.82 v32.15,18.54 | v8.53,15.75 8.28,16 v8.28,20.57 | v5.74,28.7 3.45,30.99 v3.45,33.78 | v32.41,12.19 32.79,12.57 v32.79,16.38
  Bottom 0.254: 44.42,72.13 22.76,72.13 21.23,70.61 21.23,68.07 18.95,65.78 4.21,65.78 2.18,63.5 2.18,49.78 3.2,48.77 6.75,48.77 11.07,44.45 11.07,35.3 10.31,34.54 4.21,34.54 v3.45,33.78 | v32.15,18.54 32.15,17.02 v32.79,16.38 | v32.41,12.19 27.84,12.19 26.57,13.46 25.55,13.46 23.26,15.75 v8.53,15.75 | v8.28,20.57 6.25,22.6 6.25,24.38 5.74,24.89 v5.74,28.7
  Bottom 0.406: J4.P$1 44.42,72.13
IO5  (via drill 0.3, 0.41)
  Top 0.254: v44.35,29.72 43.84,29.21 39.27,29.21 38,27.94 38,18.79 37.49,18.29 34.69,18.29 34.19,18.79 34.19,19.81 33.65,20.35 IC2.25
  Top 0.305: 51.2,46.99 51.2,55.88 55.27,59.94 J5.P$1
  Top 0.406: 51.2,46.99 v51.2,38.61
  Bottom 0.254: v44.35,29.72 44.35,31.24 44.85,31.75 46.63,31.75
  Bottom 0.305: 46.63,31.75 48.16,31.75
  Bottom 0.356: 48.16,31.75 49.68,31.75
  Bottom 0.406: v51.2,38.61 51.2,33.27 49.68,31.75
LDIN  (via drill 0.3)
  Top 0.254: IC2.18 28.87,18.79 28.85,18.79 28.34,18.29 v27.84,18.29 | R16.1 3.71,57.91 3.2,57.4 3.2,51.81 4.21,50.8 7.26,50.8 7.77,51.31 9.55,51.31 11.58,49.27 21.23,49.27 22.63,47.88 22.63,37.72 23.26,37.08 25.17,37.08 25.93,36.32 25.93,32.13 v23.77,29.97
  Bottom 0.254: v23.77,29.97 23.77,27.68 24.53,26.92 24.53,20.83 26.57,18.79 27.33,18.79 v27.84,18.29
LDOUT  (via drill 0.41)
  Top 0.406: v45.36,33.78 44.36,33.78 D25.2
  Bottom 0.406: J6.P$1 57.3,73.15 47.9,63.75 47.9,35.05 46.63,33.78 v45.36,33.78
LDR  (via drill 0.3)
  Top 0.254: 33.4,20.85 IC2.26 33.91,20.85 34.69,20.06 34.69,19.05 34.95,18.79 36.85,18.79 v37.11,19.05 | R3.1 32.19,70.58 37.74,65.02 37.74,60.45 39.01,59.69 v39.27,59.69 | v43.84,31.75 49.17,31.75 50.19,30.73 v50.19,22.1 | v37.74,15.75 v40.54,15.75
  Top 0.305: R4.2 31.84,70.79 R3.1
  Bottom 0.254: v39.27,59.69 39.27,32.51 | 37.11,19.18 v37.11,19.05 37.11,16.38 v37.74,15.75 | 40.54,31.75 v43.84,31.75 | v40.54,15.75 50.44,15.75 51.2,16.51 51.2,21.08 v50.19,22.1
  Bottom 0.305: 40.54,31.75 40.03,31.75 39.27,32.51
N$7  (via drill 0.3)
  Top 0.305: Q4.3 v11.16,55.71 | v12.6,56.39 15.64,56.39 v16.41,55.62 | v40.54,49.53 39.52,49.53 38.76,50.29 37.49,50.29 36.98,49.78 v35.46,49.78 | v46.89,52.83 v49.17,52.83
  Bottom 0.305: v11.16,55.71 11.92,55.71 v12.6,56.39 | v16.41,55.62 20.34,55.62 26.18,49.78 26.69,50.29 34.69,50.29 35.2,49.78 v35.46,49.78 | v40.54,49.53 41.04,49.53 44.35,52.83 v46.89,52.83 | SG1.- 51.07,49.4 49.17,51.31 v49.17,52.83
N$8
  Top 0.305: Q4.1 4.83,53.31 R15.2
N$9
  Top 0.406: R14.1 29.11,8.19 J15.USB_P
N$10
  Top 0.305: J15.5V 33.62,16.2 34.44,17.02 39.73,17.02 F1.2
N$11
  Top 0.406: R13.1 31.14,8.41 J15.USB_M
N$13
  Top 0.305: D1.4 16.95,63.96 15.88,65.02 8.79,65.02 7.77,64.01 7.77,58.42 7.26,57.91 R16.2
N$15
  Top 0.61: Q1.3 55.52,19.05 J14.P$1 59.33,19.3 59.33,35.05 57.81,36.57 J12.1
N$18
  Top 0.61: SW1.B 18.58,17.78 R6.2 R7.2
N$19
  Top 0.61: R8.2 R5.2 13.24,17.78 SW1.A
N$22
  Top 0.406: D1.2 D6.4
N$27
  Top 0.406: D6.2 D11.4
N$32  (via drill 0.3)
  Top 0.254: D11.2 15.44,48.06 v15.9,48.51 | v15.9,44.7 17,44.7 D16.4
  Bottom 0.254: v15.9,48.51 v15.9,44.7
N$33
  Top 0.254: IC2.14 25.82,21.35 25.55,21.08 25.55,17.02 25.8,16.76 28.23,16.76 R14.2 29.11,16 29.87,16.76 31.14,16.76 31.39,17.02 33.42,17.02 34.19,17.78 37.74,17.78 38.5,18.54 38.5,27.68 39.01,28.19 R12.2
N$34  (via drill 0.3)
  Top 0.254: 27.49,21.84 25.55,21.84 25.04,21.33 25.04,16.76 25.55,16.25 27.58,16.25 28.09,15.75 v28.09,13.21 | 31.28,15.75 arc-90 R13.2 31.25,16 31.65,16 32.15,15.49 v32.15,13.21
  Top 0.305: 27.49,21.84 IC2.13
  Bottom 0.254: v32.15,13.21 31.9,13.46 28.34,13.46 v28.09,13.21
N$35
  Top 0.305: R12.1 40.93,26.89 Q3.3
N$36  (via drill 0.3)
  Top 0.254: IC2.15 27.48,20.83 26.31,20.83 26.06,20.57 26.06,17.78 v26.31,17.52 | v39.27,22.6 39.27,23.34 Q3.1
  Bottom 0.254: v39.27,22.6 38.76,22.1 38.76,15.75 38,14.98 26.31,14.98 25.3,16 25.3,17.27 25.55,17.52 v26.31,17.52
N$40
  Top 0.406: D16.2 D21.4
N$41
  Top 0.406: D2.2 D7.4
N$46
  Top 0.406: D7.2 D12.4
N$49  (via drill 0.3)
  Top 0.305: v24.79,45.72 24.79,44.94 D17.4 | v21.23,48 21.18,48.06 D12.2
  Bottom 0.305: v24.79,45.72 22.5,48 v21.23,48
N$52  (via drill 0.3)
  Top 0.305: D17.2 19.92,40.93 v19.96,40.89 | v24.79,39.37 24.79,38.59 D22.4
  Bottom 0.305: v19.96,40.89 23.26,40.89 v24.79,39.37
N$53
  Top 0.406: D3.2 D8.4
N$58
  Top 0.406: D8.2 D13.4
N$61
  Top 0.406: D13.2 D18.4
N$64
  Top 0.406: D18.2 D23.4
N$65
  Top 0.406: D4.2 D9.4
N$70
  Top 0.406: D9.2 D14.4
N$73
  Top 0.406: D14.2 D19.4
N$76
  Top 0.406: D19.2 D24.4
N$77
  Top 0.406: D5.2 D10.4
N$82
  Top 0.406: D10.2 D15.4
N$85
  Top 0.406: D15.2 D20.4
N$88
  Top 0.406: D20.2 D25.4
N$91  (via drill 0.3)
  Top 0.305: D21.2 13.56,35.36 v13.61,35.3 | v23.01,64.01 24.65,64.01 D2.4
  Bottom 0.305: v13.61,35.3 13.61,61.97 15.14,63.5 22.5,63.5 v23.01,64.01
N$92  (via drill 0.3)
  Top 0.305: v30.88,64.01 32.39,64.01 D3.4 | v19.96,36.19 19.96,35.39 D22.2
  Bottom 0.305: v30.88,64.01 29.87,62.99 15.39,62.99 14.12,61.72 14.12,38.1 15.64,36.57 19.58,36.57 v19.96,36.19
N$93  (via drill 0.3)
  Top 0.305: D23.2 28.8,35.36 v28.85,35.3 | v38.76,64.01 40.01,64.01 D4.4
  Bottom 0.305: v28.85,35.3 27.07,37.08 15.9,37.08 14.63,38.35 14.63,61.47 15.64,62.48 37.23,62.48 v38.76,64.01
N$94  (via drill 0.3)
  Top 0.305: D24.2 36.42,35.36 v36.47,35.3 | v46.38,64.01 47.63,64.01 D5.4
  Bottom 0.305: v36.47,35.3 29.87,35.3 27.58,37.59 16.15,37.59 15.14,38.61 15.14,61.21 15.9,61.97 44.35,61.97 v46.38,64.01
P0.3/ISP_COMMAND_USB_HIGH  (via drill 0.3)
  Top 0.254: IC2.9 24,23.85 22.76,22.6 v19.71,22.6
  Top 0.305: R11.1 R10.2 40.54,19.29 40.54,18.79 39.77,18.03 v39.52,18.03
  Bottom 0.254: v19.71,22.6 24.79,17.52 24.79,15.75 26.06,14.48 38.25,14.48 39.27,15.49 39.27,17.78 v39.52,18.03
PROGR  (via drill 0.3)
  Top 0.254: IC2.3 30.87,26.91 31.39,27.43 v32.41,27.43 | S3.1 49.16,17.51 v50.19,18.54 | v40.79,30.73 40.28,30.22 38.76,30.22 36.73,28.19 v36.73,27.43 | v49.43,24.89 v49.43,21.33
  Bottom 0.254: v50.19,18.54 50.19,20.57 v49.43,21.33 | v40.79,30.73 40.79,25.4 41.81,24.38 48.92,24.38 v49.43,24.89 | v32.41,27.43 v36.73,27.43
RXD  (via drill 0.3)
  Top 0.254: IC2.31 34.17,23.35 35.71,24.89 35.71,32.76 34.95,33.53 34.19,33.53 v33.93,33.78 | v22.76,33.53 v21.49,32.26
  Bottom 0.254: v21.49,32.26 20.22,30.99 11.83,30.99 9.8,33.02 J9.P$2 J9.P$1 | v22.76,33.53 23.01,33.78 v33.93,33.78
SCL  (via drill 0.3)
  Top 0.254: IC2.10 24.26,23.35 22.76,21.84 7.52,21.84 4.98,24.38 v4.98,27.43
  Bottom 0.254: v4.98,27.43 J10.P$2 J10.P$1
SDA  (via drill 0.3)
  Top 0.254: v3.96,24.64 7.26,21.33 23.01,21.33 24.52,22.85 IC2.11
  Bottom 0.254: v3.96,24.64 J11.P$2 J11.P$1
SW
  Top 0.254: R9.1 45.11,29.57 45.11,30.22 44.85,30.48 44.09,30.48 43.33,29.72 39.01,29.72 37.49,28.19 37.49,20.32 36.22,19.3 35.46,19.3 35.2,19.56 35.2,20.32 34.19,21.33 32.76,21.33 IC2.27
  Top 0.305: R9.1 45.22,26.3 47.77,23.75 47.77,22.11 S2.3
TXD  (via drill 0.3)
  Top 0.254: IC2.32 33.9,23.85 35.2,25.14 35.2,32.51 34.69,33.02 v33.17,33.02 | v21.49,31.24 23.26,33.02 v23.52,33.02
  Bottom 0.254: v21.49,31.24 20.72,30.48 11.83,30.48 11.58,30.22 J8.P$2 J8.P$1 | v23.52,33.02 v33.17,33.02
USBIN
  Top 0.305: R10.1 40.48,20.91 F1.1 43.62,20.91 D26.A
VCC  (via drill 0.3, 0.41)
  Top 0.305: D11.1 12.3,50.58 12.6,50.29 18.18,50.29 18.69,50.8 v18.69,51.05 | D16.1 12.3,44.23 12.6,43.94 v18.69,43.94 | 51.47,24.87 50.95,24.35 50.95,20.57 50.19,19.81 v49.43,19.81 | v47.9,19.81 D26.C
  Top 0.406: D2.1 18.69,62.85 18.69,56.37 | 18.69,56.37 v18.69,51.05 19.72,51.05 D12.1 | 26.31,62.72 D3.1 29.27,62.23 33.44,62.23 D4.1 | 26.31,62.72 26.31,56.37 | 26.31,56.37 26.31,50.02 | 26.31,50.02 26.31,46.14 D18.1 26.83,44.19 v26.57,44.19 | D4.1 33.93,62.72 33.93,56.37 | 33.93,56.37 33.93,50.02 | 33.93,50.02 33.93,43.67 | 33.93,43.67 33.93,39.79 D24.1 36.89,36.83 41.06,36.83 D25.1 | 41.55,56.37 41.55,62.72 D5.1 42.78,63.79 44.09,62.48 48.66,62.48 49.43,63.24 C12.1 | 41.55,56.37 41.55,50.02 | 41.55,50.02 41.55,43.67 | 41.55,43.67 41.55,39.79 D25.1 | D7.1 18.69,56.37 | D8.1 26.31,56.37 | D13.1 26.31,50.02 | D9.1 33.93,56.37 | D14.1 33.93,50.02 | D19.1 33.93,43.67 | 41.55,56.37 D10.1 42.78,57.44 43.84,56.39 48.55,56.39 C13.1 | 41.55,50.02 D15.1 42.78,51.09 43.84,50.04 48.55,50.04 C14.1 | 41.55,43.67 D20.1 42.78,44.74 43.84,43.69 48.55,43.69 C15.1 | D2.1 18.07,62.23 14.03,62.23 D1.1 11.07,62.72 11.07,57.91 11.38,57.61 D6.1 | D21.1 14.03,36.83 18.2,36.83 D22.1 19.5,38.56 v18.69,39.37 | D2.1 20.01,63.96 21.74,62.23 25.82,62.23 26.31,62.72 | 49.43,36.46 48.55,37.34 43.84,37.34 42.78,38.39 D25.1 | C11.A 33.93,66.8 35.2,65.53 35.2,63.99 D4.1 | 54.54,31.35 IC1.3 | v18.69,43.94 18.96,43.94 D17.1 | D23.1 27.38,38.56 v26.57,39.37
  Top 0.61: 54.54,31.35 C4.2 C3.2 51.35,29.86 50.95,29.46 50.95,25.4 51.47,24.87 Q1.2 | IC1.3 54.57,32.83 55.01,33.27 55.52,33.27 | IC1.1 56.47,32.83 56.03,33.27 55.52,33.27 | 55.52,33.27 55.52,34.8 54.11,36.21 C16.1 49.43,36.46
  Bottom 0.305: v18.69,51.05 v18.69,43.94 | v49.43,19.81 v47.9,19.81
  Bottom 0.406: v18.69,39.37 v18.69,43.94 26.31,43.94 v26.57,44.19 v26.57,39.37
  pour Top: 50.95,24.13 50.95,25.14 50.82,25.27 51.08,25.27 51.46,24.89 51.46,24.64
VIB  (via drill 0.3)
  Top 0.254: IC2.28 34.44,21.85 35.46,20.83 v36.22,20.83 | v35.71,15.75 34.95,14.98 v34.95,13.71 | R2.2 4.21,59.18 2.69,57.66 2.69,51.56 3.96,50.29 7.52,50.29 10.82,46.99 21.23,46.99 22.12,46.1 22.12,34.16 20.72,32.76 20.72,28.7 18.69,26.67 18.69,24.64 18.18,24.13 v17.68,24.13
  Top 0.305: R2.2 4.83,62.34 S1.1
  Bottom 0.254: v36.22,20.83 36.22,16.25 v35.71,15.75 | v34.95,13.71 arc90 34.69,13.97 25.8,13.97 24.28,15.49 24.28,17.27 21.99,19.56 16.41,19.56 16.15,19.3 15.39,19.3 15.14,19.56 10.56,19.56 9.29,18.29 8.28,18.29 8.02,18.54 8.02,19.3 8.79,20.06 9.04,20.06 12.85,23.87 16.91,23.87 17.17,24.13 v17.68,24.13
XTALIN
  Top 0.254: 31.67,30.11 30.77,30.11 30.12,29.46 30.12,28.19 30.38,27.68 30.38,24.73 IC2.4
  Top 0.305: C9.1 31.67,30.11 Q2.3
XTALOUT
  Top 0.254: IC2.5 29.87,27.46 Q2.1
  Top 0.305: C10.1 28.77,28.81 Q2.1

### Text on the board
SilkTOP: MINIBLIP
SilkBOT: circolab.org/miniblip